# Altium schematic sheet ra-chan.SchDoc
size A3
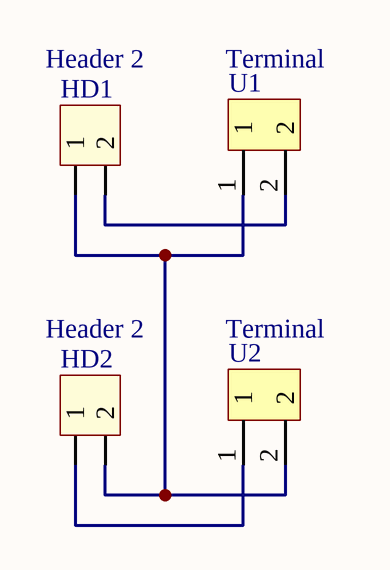
[diagram p0: ra-chan.SchDoc]

## Parts
HD1  Header 2  [HED2]
HD2  Header 2  [HED2]
U1  Terminal  [Terminal 5.08]
U2  Terminal  [Terminal 5.08]

## Nets
NetHD1_1: HD1.1 HD2.2 U1.1 U2.2
NetHD1_2: HD1.2 U1.2
NetHD2_1: HD2.1 U2.1

## Library data of the parts
HD1 HD2 = Hed2: Header 2 (Green); Value: Header 2
U1 U2 = TERMINAL5.08